# Altium schematic sheet Copy of ADN175_08_00_000_E4.SchDoc
size 604 x 426 mm; Organization: АДАНИ; Address1: -; Address4: Схема электрическая соединений; DocumentNumber: АДН175.08.00.000 Э4; Revision: АДН175.08.00.000; SheetNumber: 1; SheetTotal: 3; ApprovedBy: Фадеев; Author: Костин; DrawnBy: Лукашевич; Engineer: Монтволинская; Litera: 0; Формат: А1; DocumentName: КАБЕЛЬ
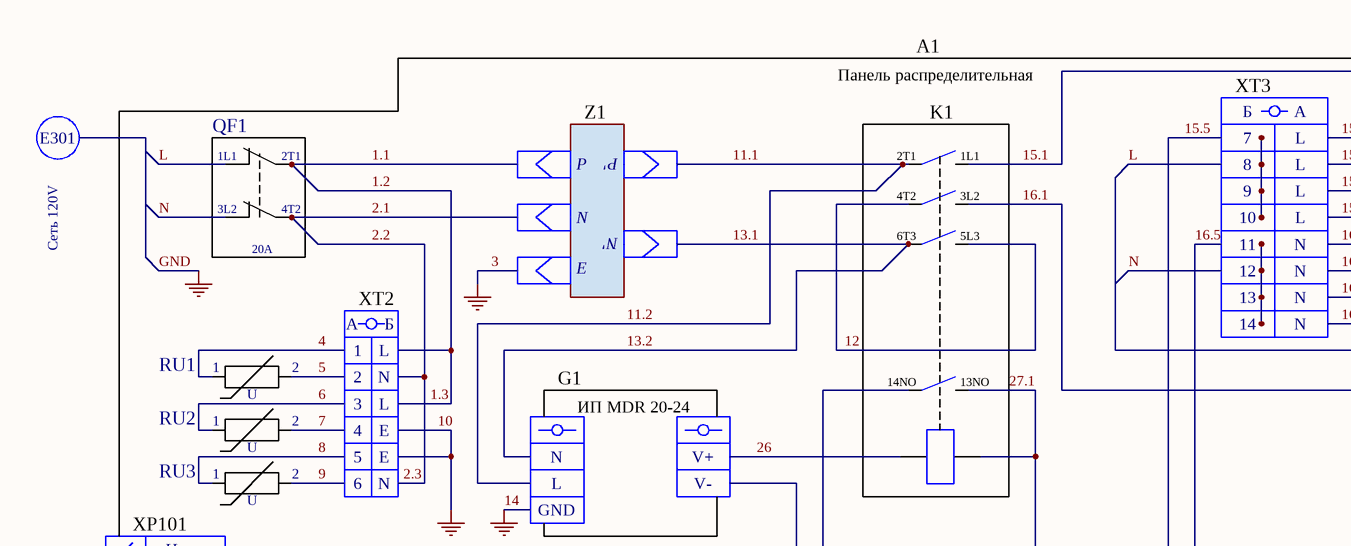
[diagram p0: Copy of ADN175_08_00_000_E4.SchDoc, top left]
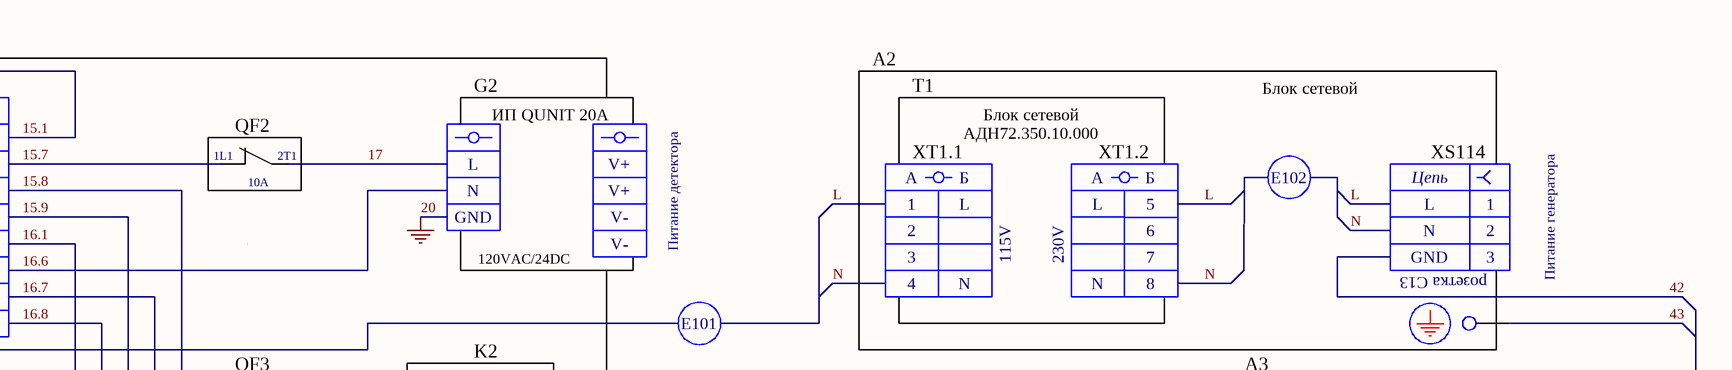
[diagram p1: Copy of ADN175_08_00_000_E4.SchDoc, top right]
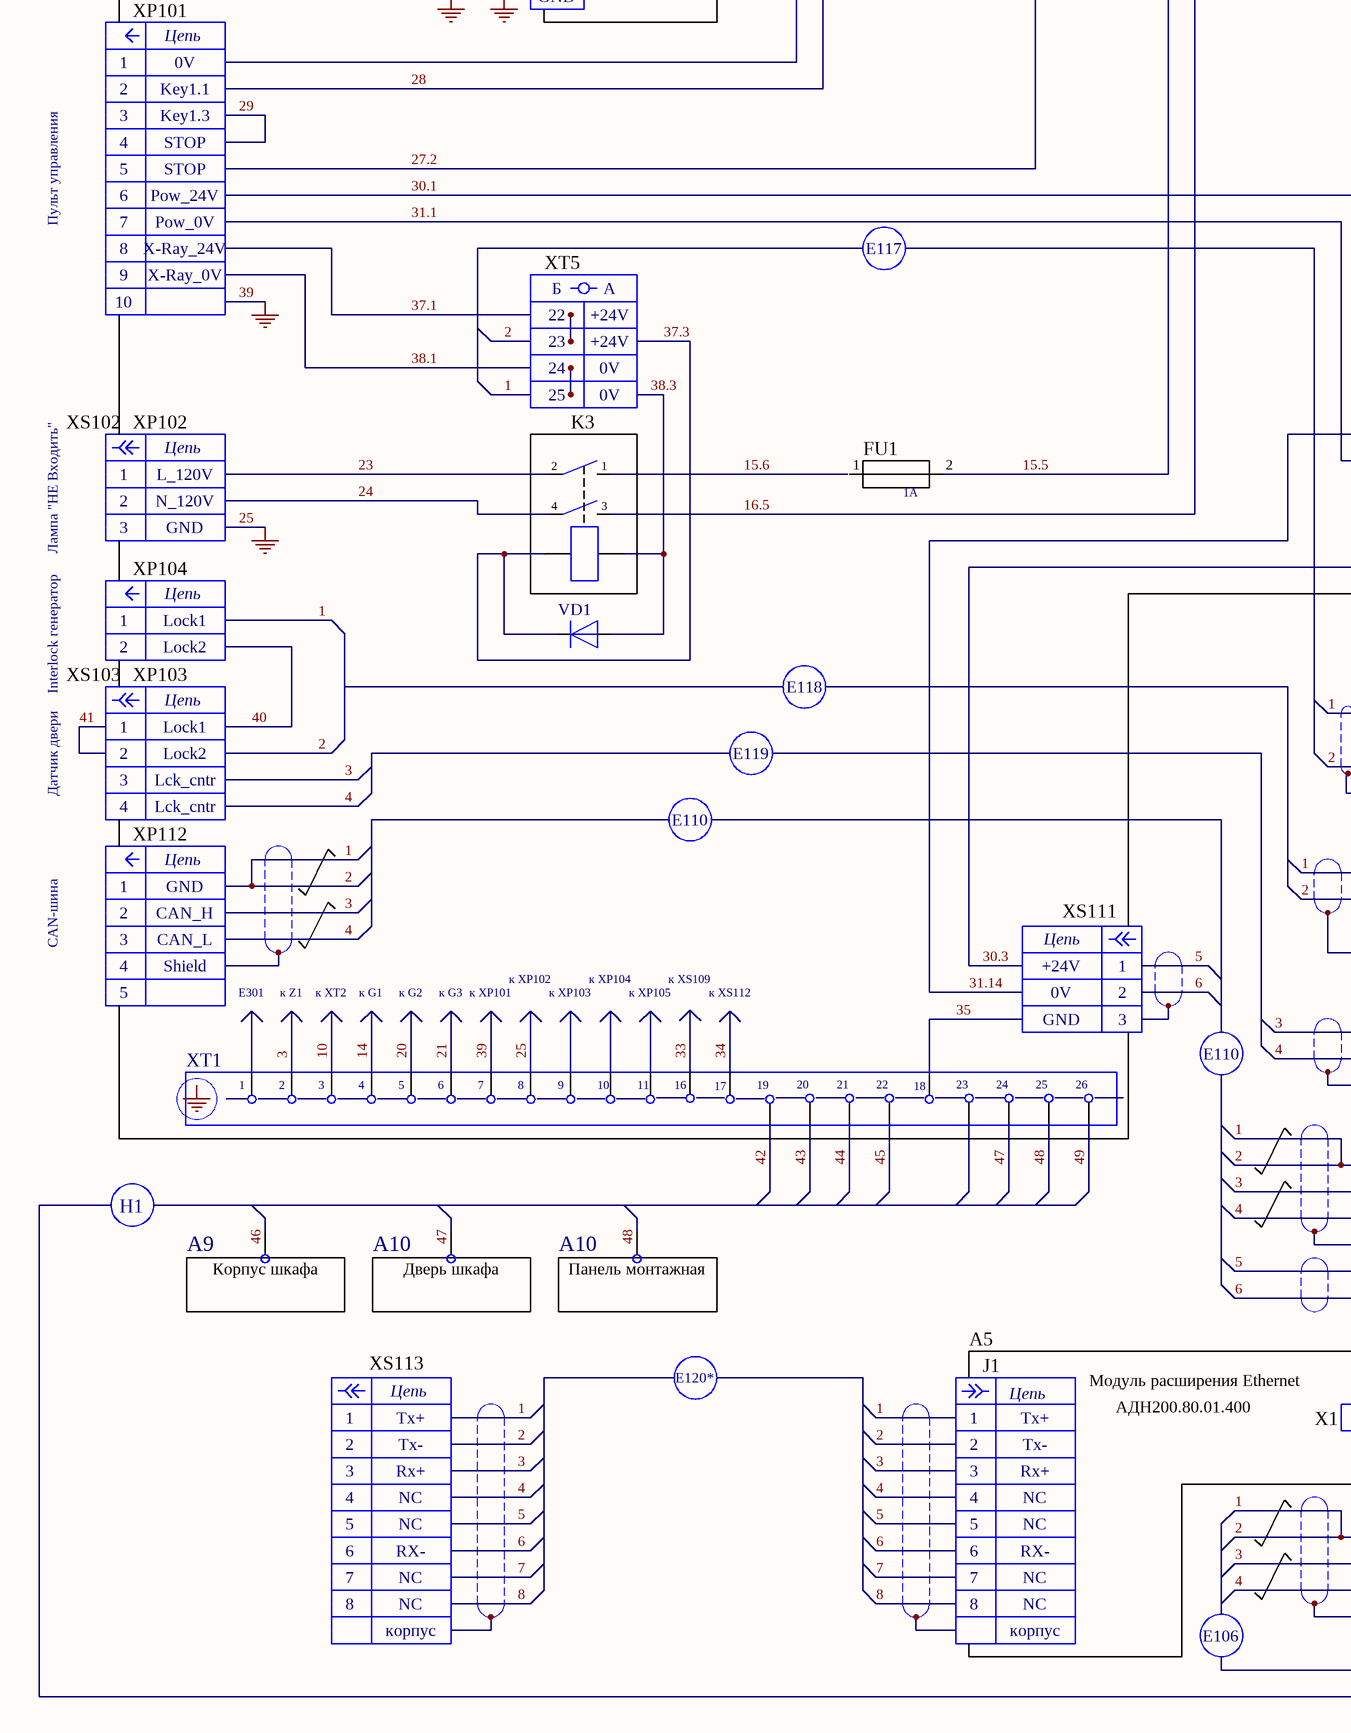
[diagram p2: Copy of ADN175_08_00_000_E4.SchDoc, bottom left]
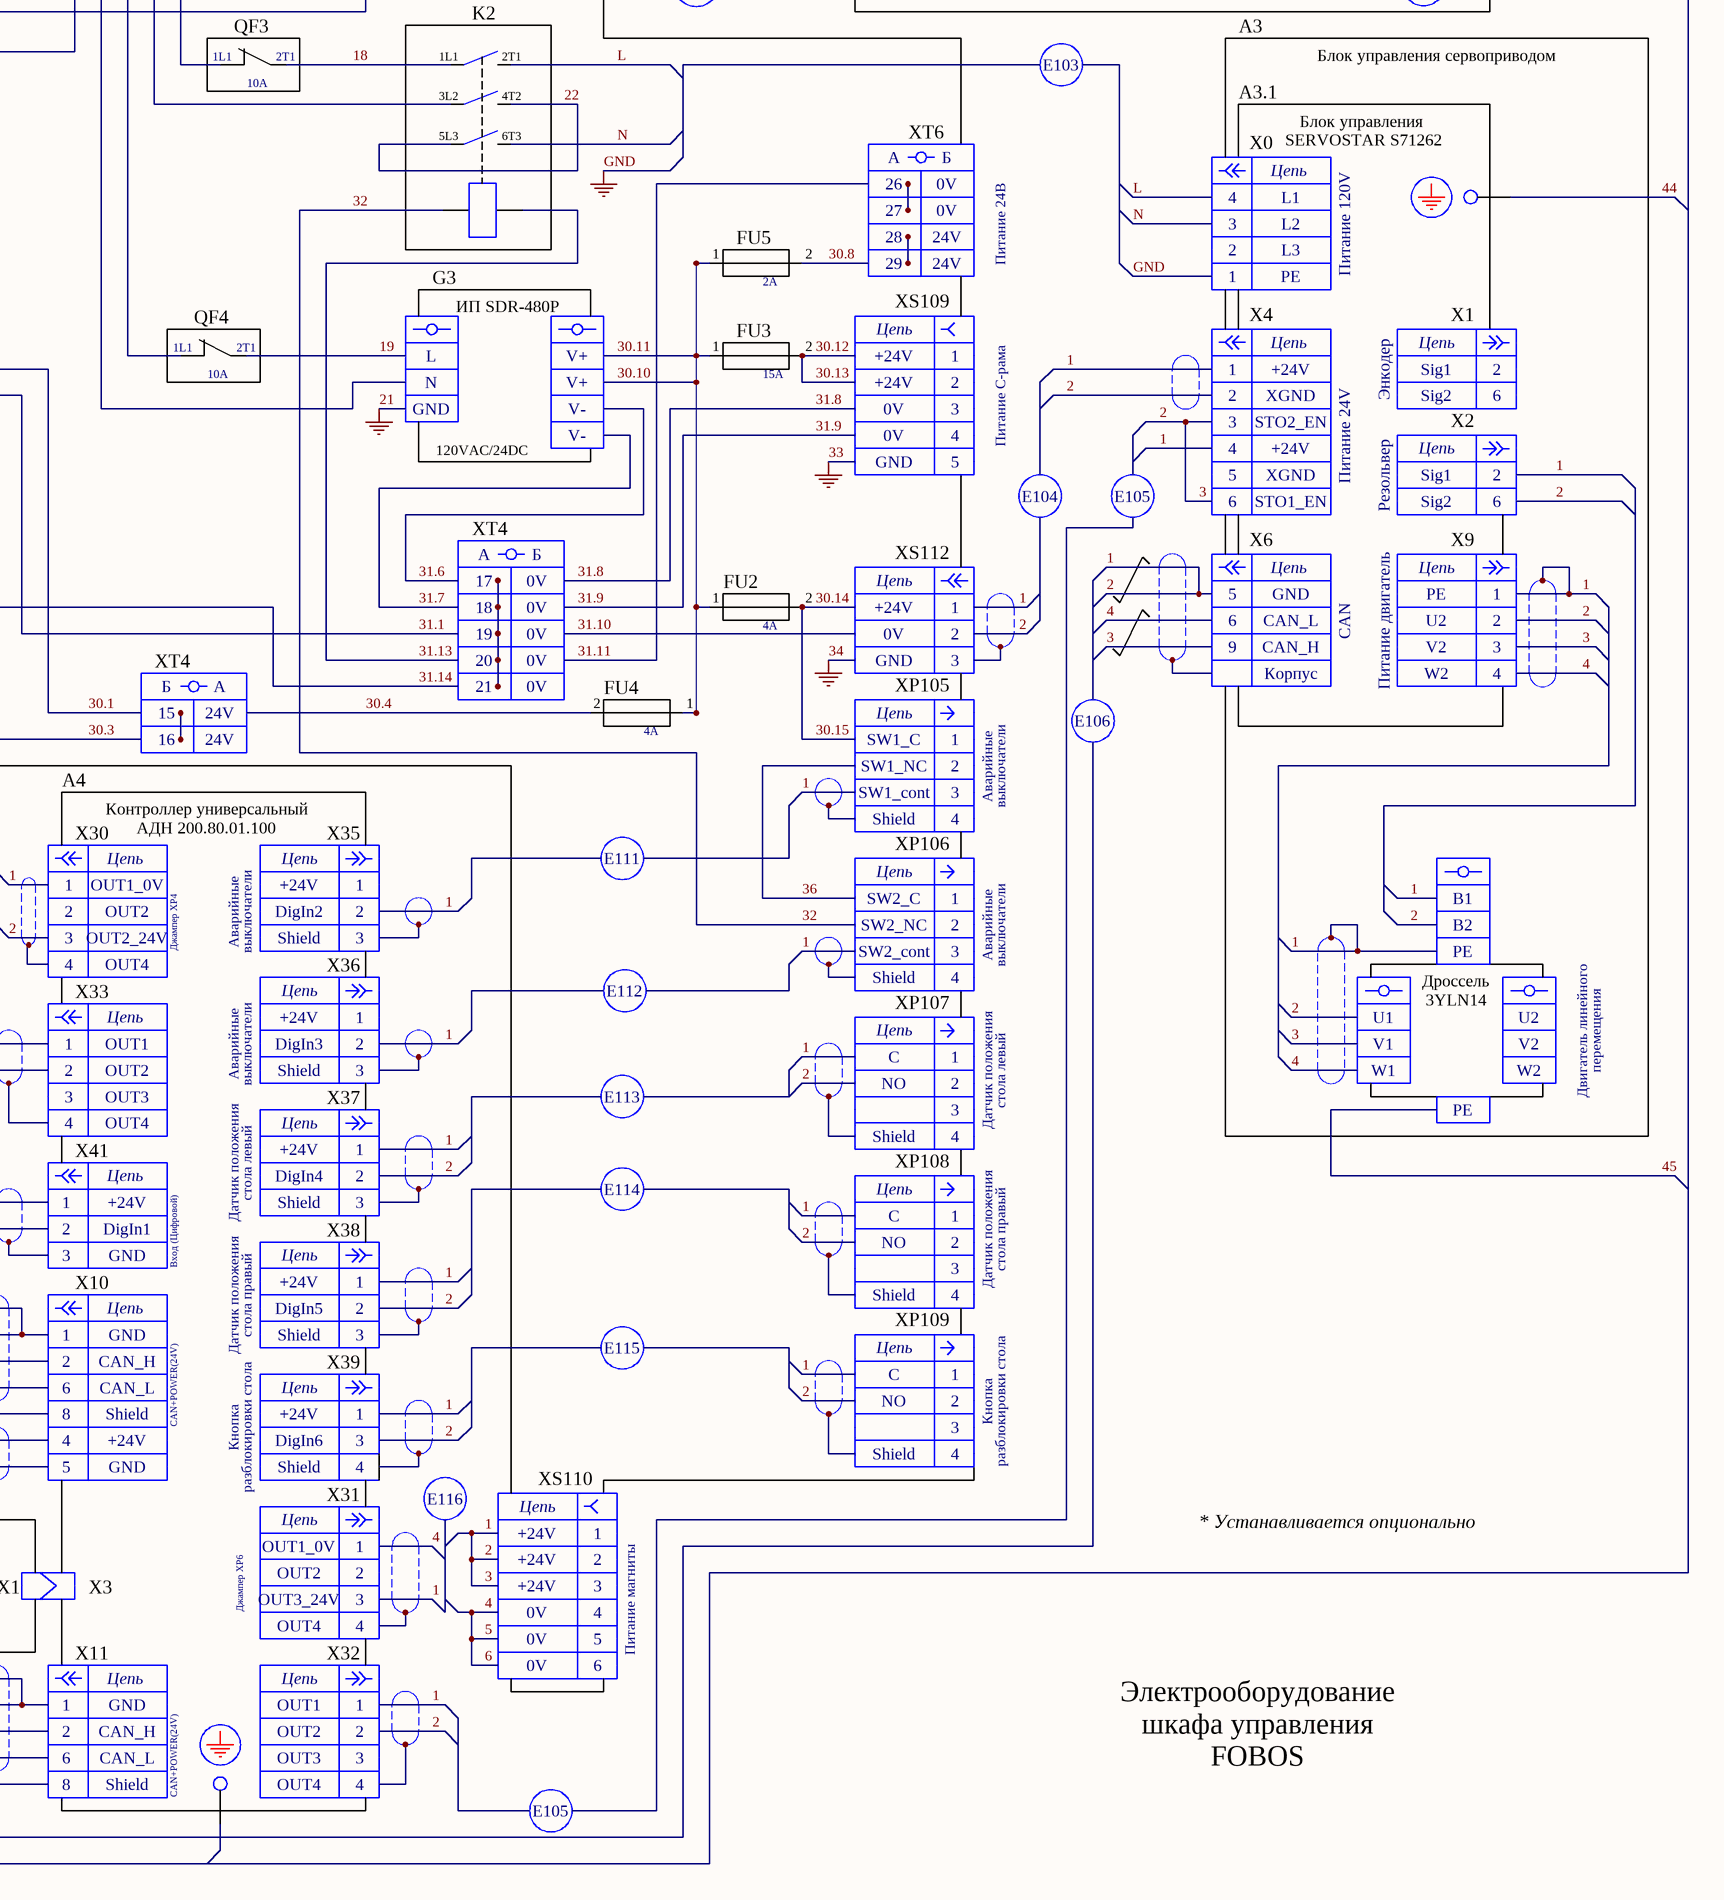
[diagram p3: Copy of ADN175_08_00_000_E4.SchDoc, bottom right]

## Parts
(Parts that share a designator on the sheet are numbered #1, #2 ... from top to bottom, then left to right.)
1  КОНТ_ПЛ_1  [PLS-1]  (value not drawn)
2  КОНТ_ПЛ_1  [PLS-1]  (value not drawn)
3  КОНТ_ПЛ_1  [PLS-1]  (value not drawn)
4  КОНТ_ПЛ_1  [PLS-1]  (value not drawn)
5  КОНТ_ПЛ_1  [PLS-1]  (value not drawn)
6  КОНТ_ПЛ_1  [PLS-1]  (value not drawn)
7  КОНТ_ПЛ_1  [PLS-1]  (value not drawn)
8  КОНТ_ПЛ_1  [PLS-1]  (value not drawn)
9  КОНТ_ПЛ_1  [PLS-1]  (value not drawn)
10  КОНТ_ПЛ_1  [PLS-1]  (value not drawn)
11  КОНТ_ПЛ_1  [PLS-1]  (value not drawn)
16  КОНТ_ПЛ_1  [PLS-1]  (value not drawn)
17  КОНТ_ПЛ_1  [PLS-1]  (value not drawn)
18  КОНТ_ПЛ_1  [PLS-1]  (value not drawn)
19  КОНТ_ПЛ_1  [PLS-1]  (value not drawn)
20  КОНТ_ПЛ_1  [PLS-1]  (value not drawn)
21  КОНТ_ПЛ_1  [PLS-1]  (value not drawn)
22  КОНТ_ПЛ_1  [PLS-1]  (value not drawn)
23  КОНТ_ПЛ_1  [PLS-1]  (value not drawn)
24  КОНТ_ПЛ_1  [PLS-1]  (value not drawn)
25  КОНТ_ПЛ_1  [PLS-1]  (value not drawn)
26  КОНТ_ПЛ_1  [PLS-1]  (value not drawn)
*#1  Component_1  (value not drawn)
*#2  Component_1  (value not drawn)
*#3  Component_1  (value not drawn)
*#4  Component_1  (value not drawn)
*#5  Component_1  (value not drawn)
*#6  Component_1  (value not drawn)
*#7  Component_1  (value not drawn)
*#8  Component_1  (value not drawn)
*#9  Component_1  (value not drawn)
*#10  Component_1  (value not drawn)
*#11  Component_1  (value not drawn)
*#12  Component_1  (value not drawn)
*#13  Component_1  (value not drawn)
*#14  in  (value not drawn)
*#15  in  (value not drawn)
*#16  in  (value not drawn)
*#17  in  (value not drawn)
*#18  in  (value not drawn)
*#19  in  (value not drawn)
*#20  in  (value not drawn)
*#21  in  (value not drawn)
*#22  in  (value not drawn)
*#23  in  (value not drawn)
*#24  in  (value not drawn)
*#25  in  (value not drawn)
*#26  in  (value not drawn)
*?#1  Component_1  (value not drawn)
*?#2  Component_1  (value not drawn)
*?#3  Component_1  (value not drawn)
*?#4  Component_1  (value not drawn)
*?#5  Component_1  (value not drawn)
*?#6  Component_1  (value not drawn)
*?#7  Component_1  (value not drawn)
*?#8  Component_1  (value not drawn)
*?#9  Component_1  (value not drawn)
*?#10  Component_1  (value not drawn)
*?#11  Component_1  (value not drawn)
*?#12  Component_1  (value not drawn)
*?#13  Component_1  (value not drawn)
*?#14  Component_1  (value not drawn)
*?#15  Component_1  (value not drawn)
*?#16  Component_1  (value not drawn)
*?#17  Component_1  (value not drawn)
*?#18  Component_1  (value not drawn)
*?#19  Component_1  (value not drawn)
*?#20  Component_1  (value not drawn)
*?#21  Component_1  (value not drawn)
*?#22  Component_1  (value not drawn)
*?#23  Component_1  (value not drawn)
*?#24  Component_1  (value not drawn)
*?#25  Component_1  (value not drawn)
*?#26  Component_1  (value not drawn)
*?#27  Component_1  (value not drawn)
*?#28  Component_1  (value not drawn)
*?#29  Component_1  (value not drawn)
*?#30  Component_1  (value not drawn)
*?#31  Component_1  (value not drawn)
*?#32  Component_1  (value not drawn)
*?#33  Component_1  (value not drawn)
*?#34  Component_1  (value not drawn)
*?#35  Component_1  (value not drawn)
*?#36  Component_1  (value not drawn)
*?#37  Component_1  (value not drawn)
*?#38  Component_1  (value not drawn)
*?#39  Component_1  (value not drawn)
*?#40  Component_1  (value not drawn)
*?#41  Component_1  (value not drawn)
*?#42  Component_1  (value not drawn)
*?#43  Component_1  (value not drawn)
*?#44  Component_1  (value not drawn)
*?#45  Component_1  (value not drawn)
*?#46  Component_1  (value not drawn)
*?#47  Component_1  (value not drawn)
*?#48  Component_1  (value not drawn)
*?#49  Component_1  (value not drawn)
*?#50  Component_1  (value not drawn)
*?#51  Component_1  (value not drawn)
*?#52  Component_1  (value not drawn)
*?#53  Component_1  (value not drawn)
*?#54  Component_1  (value not drawn)
*?#55  Component_1  (value not drawn)
*?#56  Component_1  (value not drawn)
*?#57  Component_1  (value not drawn)
*?#58  Component_1  (value not drawn)
*?#59  Component_1  (value not drawn)
*?#60  Component_1  (value not drawn)
*?#61  Component_1  (value not drawn)
*?#62  Component_1  (value not drawn)
*?#63  Component_1  (value not drawn)
*?#64  Component_1  (value not drawn)
*?#65  Component_1  (value not drawn)
*?#66  Component_1  (value not drawn)
*?#67  Component_1  (value not drawn)
*?#68  Component_1  (value not drawn)
*?#69  Component_1  (value not drawn)
*?#70  Component_1  (value not drawn)
*?#71  Component_1  (value not drawn)
*?#72  Component_1  (value not drawn)
*?#73  Component_1  (value not drawn)
*?#74  Component_1  (value not drawn)
*?#75  Component_1  (value not drawn)
*?#76  Component_1  (value not drawn)
*?#77  Component_1  (value not drawn)
*?#78  Component_1  (value not drawn)
?#1  Цепь  Обозначение?: XS114
?#2  Цепь  Обозначение?: X0
?#3  GND  (value not drawn)
?#4  Цепь  Обозначение?: XP101
?#5  GND  (value not drawn)
?#6  GND  (value not drawn)
?#7  GND  (value not drawn)
?#8  Цепь  Обозначение?: X4
?#9  Цепь  Обозначение?: XS109
?#10  GND  (value not drawn)
?#11  Цепь  Обозначение?: X1
?#12  GND  (value not drawn)
?#13  GND  (value not drawn)
?#14  GND  (value not drawn)
?#15  GND  (value not drawn)
?#16  Цепь  Обозначение?: X2
?#17  GND  (value not drawn)
?#18  Цепь  Обозначение?: X6
?#19  GND  (value not drawn)
?#20  Цепь  Обозначение?: X9
?#21  Цепь  Обозначение?: XS112
?#22  Цепь  Обозначение?: XP102
?#23  GND  (value not drawn)
?#24  GND  (value not drawn)
?#25  GND  (value not drawn)
?#26  Цепь  Обозначение?: XP105
?#27  Цепь  Обозначение?: XP104
?#28  Цепь  Обозначение?: X30
?#29  Цепь  Обозначение?: XP103
?#30  Цепь  Обозначение?: X35
?#31  Цепь  Обозначение?: XP106
?#32  Цепь  Обозначение?: X33
?#33  Цепь  Обозначение?: X36
?#34  Цепь  Обозначение?: XP112
?#35  Цепь  Обозначение?: XP107
?#36  Цепь  Обозначение?: XS111
?#37  Цепь  Обозначение?: X37
?#38  Цепь  Обозначение?: X41
?#39  Цепь  Обозначение?: XP108
?#40  Цепь  Обозначение?: X38
?#41  Цепь  Обозначение?: X10
?#42  Цепь  Обозначение?: XP109
?#43  Цепь  Обозначение?: X39
?#44  XT11  [PLS-1]  (value not drawn)
?#45  XT11  [PLS-1]  (value not drawn)
?#46  XT11  [PLS-1]  (value not drawn)
?#47  Цепь  Обозначение?: XS110
?#48  Цепь  Обозначение?: X31
?#49  Цепь  Обозначение?: XS113
?#50  Цепь  Обозначение?: J1
?#51  GND  (value not drawn)
?#52  GND  (value not drawn)
?#53  GND  (value not drawn)
?#54  GND  (value not drawn)
?#55  Цепь  Обозначение?: X11
?#56  GND  (value not drawn)
?#57  Цепь  Обозначение?: X32
?#58  GND  (value not drawn)
?#59  GND  (value not drawn)
?#60  GND  (value not drawn)
?#61  GND  (value not drawn)
E101  cable_number  (value not drawn)
E102  cable_number  (value not drawn)
E103  cable_number  (value not drawn)
E104  cable_number  (value not drawn)
E105#1  cable_number  (value not drawn)
E105#2  cable_number  (value not drawn)
E106#1  cable_number  (value not drawn)
E106#2  cable_number  (value not drawn)
E110#1  cable_number  (value not drawn)
E110#2  cable_number  (value not drawn)
E111  cable_number  (value not drawn)
E112  cable_number  (value not drawn)
E113  cable_number  (value not drawn)
E114  cable_number  (value not drawn)
E115  cable_number  (value not drawn)
E116  cable_number  (value not drawn)
E117  cable_number  (value not drawn)
E118  cable_number  (value not drawn)
E119  cable_number  (value not drawn)
E120*  cable_number  (value not drawn)
E301  cable_number  (value not drawn)
FU1  1A
FU2  4A
FU3  15A
FU4  4A
FU5  2A
H1  cable_number  (value not drawn)
K1.1#1  (no value)
K1.1#2  (no value)
K1.2#1  (no value)
K1.2#2  (no value)
K1.2#3  (no value)
K1.2#4  (no value)
K?#1  (no value)
K?#2  (no value)
K?#3  (no value)
KA?#1  RELAY  (value not drawn)
KA?#2  RELAY  (value not drawn)
KA?#3  RELAY  (value not drawn)
QF1  20A
QF2  10A
QF3  10A
QF4  10A
RU1  varistor  (value not drawn)
RU2  varistor  (value not drawn)
RU3  varistor  (value not drawn)
VD1  DIODE1  [0805]  (value not drawn)
X1  male  (value not drawn)
X3  female  (value not drawn)
XK?#1  КОНТАКТ_ПЛ  [PLS-1]  (value not drawn)
XK?#2  КОНТАКТ_ПЛ  [PLS-1]  (value not drawn)
XK?#3  КОНТАКТ_ПЛ  [PLS-1]  (value not drawn)
XP?#1  male  (value not drawn)
XP?#2  male  (value not drawn)
XP?#3  male  (value not drawn)
XP?#4  male  (value not drawn)
XP?#5  male  (value not drawn)
XS?#1  female  (value not drawn)
XS?#2  female  (value not drawn)
XS?#3  female  (value not drawn)
XS?#4  female  (value not drawn)
XS?#5  female  (value not drawn)
№?#1  Цепь?  (value not drawn)
№?#2  Цепь?  (value not drawn)
№?#3  Цепь?  (value not drawn)
№?#4  Цепь?  (value not drawn)
№?#5  Цепь?  (value not drawn)
№?#6  Цепь?  (value not drawn)
№?#7  Цепь?  (value not drawn)
№?#8  Цепь?  (value not drawn)
№?#9  Цепь?  (value not drawn)
№?#10  Цепь?  (value not drawn)
№?#11  Цепь?  (value not drawn)
№?#12  Цепь?  (value not drawn)
№?#13  Цепь?  (value not drawn)
№?#14  Цепь?  (value not drawn)
№?#15  Цепь?  (value not drawn)
№?#16  Цепь?  (value not drawn)
№?#17  Цепь?  (value not drawn)
№?#18  Цепь?  (value not drawn)
№?#19  Цепь?  (value not drawn)
№?#20  Цепь?  (value not drawn)
№?#21  Цепь?  (value not drawn)
№?#22  Цепь?  (value not drawn)
№?#23  Цепь?  (value not drawn)
№?#24  Цепь?  (value not drawn)
№?#25  Цепь?  (value not drawn)
№?#26  Цепь?  (value not drawn)
№?#27  Цепь?  (value not drawn)
№?#28  Цепь?  (value not drawn)
№?#29  Цепь?  (value not drawn)
№?#30  Цепь?  (value not drawn)
№?#31  Цепь?  (value not drawn)
№?#32  Цепь?  (value not drawn)
№?#33  Цепь?  (value not drawn)
№?#34  Цепь?  (value not drawn)
№?#35  Цепь?  (value not drawn)
№?#36  Цепь?  (value not drawn)
№?#37  Цепь?  (value not drawn)
№?#38  Цепь?  (value not drawn)
№?#39  Цепь?  (value not drawn)
№?#40  Цепь?  (value not drawn)
№?#41  Цепь?  (value not drawn)
№?#42  Цепь?  (value not drawn)
№?#43  Цепь?  (value not drawn)
№?#44  Цепь?  (value not drawn)
№?#45  Цепь?  (value not drawn)
№?#46  Цепь?  (value not drawn)
№?#47  Цепь?  (value not drawn)
№?#48  Цепь?  (value not drawn)
№?#49  Цепь?  (value not drawn)
№?#50  Цепь?  (value not drawn)
№?#51  Цепь?  (value not drawn)
№?#52  Цепь?  (value not drawn)
№?#53  Цепь?  (value not drawn)
№?#54  Цепь?  (value not drawn)
№?#55  Цепь?  (value not drawn)
№?#56  Цепь?  (value not drawn)
№?#57  Цепь?  (value not drawn)
№?#58  Цепь?  (value not drawn)
№?#59  Цепь?  (value not drawn)
№?#60  Цепь?  (value not drawn)
№?#61  Цепь?  (value not drawn)
№?#62  Цепь?  (value not drawn)
№?#63  Цепь?  (value not drawn)
№?#64  Цепь?  (value not drawn)
№?#65  Цепь?  (value not drawn)
№?#66  Цепь?  (value not drawn)
№?#67  Цепь?  (value not drawn)
№?#68  Цепь?  (value not drawn)
№?#69  Цепь?  (value not drawn)
№?#70  Цепь?  (value not drawn)
№?#71  Цепь?  (value not drawn)
№?#72  Цепь?  (value not drawn)
№?#73  Цепь?  (value not drawn)
№?#74  Цепь?  (value not drawn)
№?#75  Цепь?  (value not drawn)
№?#76  Цепь?  (value not drawn)
№?#77  Цепь?  (value not drawn)
№?#78  Цепь?  (value not drawn)
№?#79  Цепь?  (value not drawn)
№?#80  Цепь?  (value not drawn)
№?#81  Цепь?  (value not drawn)
№?#82  Цепь?  (value not drawn)
№?#83  Цепь?  (value not drawn)
№?#84  Цепь?  (value not drawn)
№?#85  Цепь?  (value not drawn)
№?#86  Цепь?  (value not drawn)
№?#87  Цепь?  (value not drawn)
№?#88  Цепь?  (value not drawn)
№?#89  Цепь?  (value not drawn)
№?#90  Цепь?  (value not drawn)
№?#91  Цепь?  (value not drawn)
№?#92  Цепь?  (value not drawn)
№?#93  Цепь?  (value not drawn)
№?#94  Цепь?  (value not drawn)
№?#95  Цепь?  (value not drawn)
№?#96  Цепь?  (value not drawn)
№?#97  Цепь?  (value not drawn)
№?#98  Цепь?  (value not drawn)
№?#99  Цепь?  (value not drawn)
№?#100  Цепь?  (value not drawn)
№?#101  Цепь?  (value not drawn)
№?#102  Цепь?  (value not drawn)
№?#103  Цепь?  (value not drawn)
№?#104  Цепь?  (value not drawn)
№?#105  Цепь?  (value not drawn)
№?#106  Цепь?  (value not drawn)
№?#107  Цепь?  (value not drawn)
№?#108  Цепь?  (value not drawn)
№?#109  Цепь?  (value not drawn)
№?#110  Цепь?  (value not drawn)
№?#111  Цепь?  (value not drawn)
№?#112  Цепь?  (value not drawn)
№?#113  Цепь?  (value not drawn)
№?#114  Цепь?  (value not drawn)
№?#115  Цепь?  (value not drawn)
№?#116  Цепь?  (value not drawn)
№?#117  Цепь?  (value not drawn)
№?#118  Цепь?  (value not drawn)
№?#119  Цепь?  (value not drawn)
№?#120  Цепь?  (value not drawn)
№?#121  Цепь?  (value not drawn)
№?#122  Цепь?  (value not drawn)
№?#123  Цепь?  (value not drawn)
№?#124  Цепь?  (value not drawn)
№?#125  Цепь?  (value not drawn)
№?#126  Цепь?  (value not drawn)
№?#127  Цепь?  (value not drawn)
№?#128  Цепь?  (value not drawn)
№?#129  Цепь?  (value not drawn)
№?#130  Цепь?  (value not drawn)
№?#131  Цепь?  (value not drawn)

## Blocks framed on the sheet
Z1: XP?#2 XP?#5
K1: K1.1#1 K1.1#2 K?#1 K?#2 KA?#1
K2: K1.2#1 K1.2#2 K?#3 KA?#2
K3: K1.2#3 K1.2#4 KA?#3
XT1: 1-11 16-26

## Nets
1: 2.1 3.1 4.1 5.1 6.1 7.1 8.1 16.1 17.1 *#5.0 *#8.0 *#12.0 *#14.4 *#16.4 *#17.4 *#18.4 *#19.4 *#20.4 *#21.4 *#22.4 *#26.4 *?#17.0 *?#52.0 *?#69.0 *?#70.0 *?#71.0 *?#72.0 *?#74.0 ?#7.5 ?#10.5 ?#12.5 ?#13.5 ?#14.5 ?#17.5 ?#19.5 ?#24.5 ?#51.5 ?#52.5 ?#53.5 XS?#5.10 №?#7.8 №?#8.8 №?#25.6 №?#26.6 №?#27.5 №?#28.5 №?#29.5 №?#30.5 №?#32.5 №?#33.5 №?#35.5 №?#36.6 №?#37.6 №?#40.6 №?#43.6 №?#45.5 №?#49.6 №?#51.5 №?#52.5 №?#53.6 №?#58.6 №?#60.5 №?#62.6 №?#63.5 №?#64.5 №?#65.6 №?#66.6 №?#70.6 №?#77.5 №?#79.5 №?#80.5 №?#84.6 №?#86.6 №?#88.5 №?#91.5 №?#95.6 №?#97.6 №?#99.5 №?#102.5 №?#105.6 №?#107.6 №?#108.6 №?#110.6 №?#111.6 №?#112.5 №?#113.6 №?#123.5 №?#126.5  [also labelled 10, 14, 2, 20, 21, 25, 3, 33, 34, 39, GND]
1.1: QF1.2T1 XS?#2.10 №?#4.8 №?#6.8  [also labelled 1.2, 1.3]
2.1: QF1.2T2 XS?#3.10 №?#5.8 №?#9.8  [also labelled 2.2, 2.3]
4: *?#76.0 ?#23.5 ?#54.5 ?#56.5 ?#58.5 RU1.2 RU1.3 RU2.2 №?#4.7 №?#5.7 №?#6.7 №?#38.5 №?#57.6 №?#69.6 №?#75.5 №?#78.5 №?#82.5 №?#106.5 №?#114.6 №?#116.6 №?#118.6 №?#121.6  [also labelled 5, 6]
7: ?#59.5 RU2.3 №?#7.7 №?#124.6
8: ?#60.5 RU3.2 №?#8.7 №?#127.6
9: RU3.3 №?#9.7
11.1: *#3.0 K1.1#1.2T1 XS?#1.10  [also labelled 11.2]
12: K1.1#2.4T2 K?#1.5L3
13.1: *#1.0 K?#1.6T3 XS?#4.10  [also labelled 13.2]
15.1: *?#2.1 K1.1#1.1L1
15.5: *?#1.0 FU1.2
15.6: K1.2#3.1
15.7: *?#4.1 QF2.2T2
15.8: *?#8.1 QF3.2T2
15.9: *?#16.1 QF4.2T2
16.1: *?#24.1 K1.1#2.3L2
16.5: *?#23.0 K1.2#4.3
16.6: *?#9.0 *?#31.1
16.7: *?#37.1 K1.2#2.3L2
16.8: *?#39.1 *?#50.0
17: *?#5.0 QF2.2T1
18: K1.2#1.1L1 QF3.2T1
19: *?#48.0 QF4.2T1
22: K1.2#2.4T2 K?#3.5L3
23: K1.2#3.2 №?#31.6
24: K1.2#4.4 №?#34.6
26: *#2.1 KA?#1.A1
27.1: K?#2.13NO KA?#1.A2 №?#14.6  [also labelled 27.2]
28: K?#2.14NO №?#11.6
29: №?#12.6 №?#13.6
30.1: *?#65.0 №?#15.6
30.3: *?#67.0 №?#75.6
30.4: *?#66.1 FU4.2
30.8: *?#46.0 FU5.2
30.10: *?#51.1
30.11: *?#49.1 FU3.1
30.12: FU3.2 №?#16.6 №?#19.6  [also labelled 30.13]
30.14: FU2.2 №?#30.6 №?#39.6  [also labelled 30.15]
31.1: *?#59.0 №?#17.6
31.6: *?#53.1 *?#55.0
31.7: *?#54.1 *?#57.0
31.8: *?#56.1 №?#22.6
31.9: *?#58.1 №?#24.6
31.10: *?#60.1 №?#33.6
31.11: *?#40.0 *?#62.1
31.13: *?#61.0 KA?#2.A2
31.14: *?#63.0 №?#78.6
32: KA?#2.A1 №?#54.6
35: 18.1 №?#81.6
36: №?#41.6 №?#50.6
37.1: *#6.0 №?#20.6
37.3: *#9.1 KA?#3.A1 VD1.2(K)
38.1: *#10.0 №?#23.6
38.3: *#13.1 KA?#3.A2 VD1.1(A)
40: №?#42.6 №?#46.6
41: №?#46.5 №?#49.5
42: 19.1 №?#3.6
43: 20.1 XK?#1.1
44: 21.1 XK?#2.1
45: 22.1 *?#78.0
47: 24.1
48: 25.1
49: 26.1
L: *?#3.0 *?#11.0 *?#14.1 ?#3.5 K1.2#1.2T1 QF1.2T2 №?#1.6
N: *?#30.0 *?#32.0 *?#35.1 ?#5.5 K?#3.6T3 QF1.2T3 №?#2.6
Net1_1: 1.1 *#15.4
Net9_1: 9.1 *#23.4
Net10_1: 10.1 *#24.4
Net11_1: 11.1 *#25.4
Net*#4_1: *#4.1 №?#10.6
Net*#6_1: *#6.1 *#7.0
Net*#8_1: *#8.1 *#9.0
Net*#10_1: *#10.1 *#11.0
Net*#12_1: *#12.1 *#13.0
Net*?#1_1: *?#1.1 *?#2.0
Net*?#3_1: *?#3.1 *?#4.0
Net*?#7_1: *?#7.1 *?#8.0
Net*?#11_1: *?#11.1 *?#12.0
Net*?#13_1: *?#13.1 *?#14.0
Net*?#15_1: *?#15.1 *?#16.0
Net*?#19_1: *?#19.1 *?#20.0
Net*?#21_1: *?#21.1 *?#22.0
Net*?#23_1: *?#23.1 *?#24.0
Net*?#26_1: *?#26.1 *?#27.0
Net*?#28_1: *?#28.1 *?#29.0
Net*?#30_1: *?#30.1 *?#31.0
Net*?#32_1: *?#32.1 *?#33.0
Net*?#34_1: *?#34.1 *?#35.0
Net*?#36_1: *?#36.1 *?#37.0
Net*?#38_1: *?#38.1 *?#39.0
Net*?#40_1: *?#40.1 *?#41.0
Net*?#42_1: *?#42.1 *?#43.0
Net*?#44_1: *?#44.1 *?#45.0
Net*?#46_1: *?#46.1 *?#47.0
Net*?#55_1: *?#55.1 *?#56.0
Net*?#57_1: *?#57.1 *?#58.0
Net*?#59_1: *?#59.1 *?#60.0
Net*?#61_1: *?#61.1 *?#62.0
Net*?#63_1: *?#63.1 *?#64.0
Net*?#65_1: *?#65.1 *?#66.0
Net*?#67_1: *?#67.1 *?#68.0

Not connected (* = marked no-connect by the designer): 23 1; *#1 1; *#2 0; *#3 1; *#4 0; *#5 1; *#7 1; *#11 1; *?#5 1; *?#6 0 1; *?#7 0; *?#9 1; *?#10 0 1; *?#12 1; *?#13 0; *?#15 0; *?#17 1; *?#18 0 1; *?#19 0; *?#20 1; *?#21 0; *?#22 1; *?#25 0 1; *?#26 0; *?#27 1; *?#28 0; *?#29 1; *?#33 1; *?#34 0; *?#36 0; *?#38 0; *?#41 1; *?#42 0; *?#43 1; *?#44 0; *?#45 1; *?#47 1; *?#48 1; *?#49 0; *?#50 1; *?#51 0; *?#52 1; *?#53 0; *?#54 0; *?#64 1; *?#68 1; *?#69 1; *?#70 1; *?#71 1; *?#72 1; *?#73 0 1; *?#74 1; *?#75 0 1; *?#76 1; *?#77 0 1; *?#78 1; ?#1 5; ?#4 5; ?#6 5; ?#9 5; ?#11 5; ?#15 5; ?#16 5; ?#20 5; ?#21 5; ?#22 5; ?#25 5; ?#26 5; ?#27 5; ?#29 5; ?#30 5; ?#31 5; ?#33 5; ?#34 5; ?#35 5; ?#36 5; ?#37 5; ?#38 5; ?#39 5; ?#40 5; ?#41 5; ?#42 5; ?#43 5; ?#44 1; ?#45 1; ?#46 1; ?#47 5; ?#48 5; ?#49 5; ?#55 5; ?#57 5; ?#61 5; E101 9 10 11; E102 9 10 11; E103 9 10 11; E104 9 10 11; E105#1 9 10 11; E105#2 9 10 11; E106#1 9 10 11; E106#2 9 10 11; E110#1 9 10 11; E110#2 9 10 11; E111 9 10 11; E112 9 10 11; E113 9 10 11; E114 9 10 11; E115 9 10 11; E116 9 10 11; E117 9 10 11; E118 9 10 11; E119 9 10 11; E120* 9 10 11; E301 9 10 11; FU1 1; FU2 1; FU4 1(2); FU5 1; H1 9 10 11; X1 9; X3 10; XK?#3 1; XP?#1 9; XP?#2 9; XP?#3 9; XP?#4 9; XP?#5 9; №?#1 5; №?#2 5; №?#3 5; №?#10 5; №?#11 5; №?#12 5; №?#13 5; №?#14 5; №?#15 5; №?#16 5; №?#17 5; №?#18 5 6; №?#19 5; №?#20 5; №?#21 5 6; №?#22 5; №?#23 5; №?#24 5; №?#25 5; №?#26 5; №?#27 6; №?#28 6; №?#29 6; №?#31 5; №?#32 6; №?#34 5; №?#35 6; №?#36 5; №?#37 5; №?#38 6; №?#39 5; №?#40 5; №?#41 5; №?#42 5; №?#43 5; №?#44 5 6; №?#47 5; №?#48 5 6; №?#50 5; №?#52 6; №?#53 5; №?#54 5; №?#55 5; №?#56 5 6; №?#57 5; №?#58 5; №?#59 5 6; №?#61 5 6; №?#62 5; №?#64 6; №?#65 5; №?#66 5; №?#67 5; №?#68 5 6; №?#69 5; №?#70 5; №?#71 5; №?#72 5 6; №?#73 5 6; №?#74 5 6; №?#76 5 6; №?#77 6; №?#79 6; №?#80 6; №?#81 5; №?#82 6; №?#83 5 6; №?#84 5; №?#85 5 6; №?#86 5; №?#87 5 6; №?#88 6; №?#89 5 6; №?#90 6; №?#91 6; №?#92 6; №?#93 5 6; №?#94 6; №?#95 5; №?#96 6; №?#97 5; №?#98 6; №?#99 6; №?#100 5 6; №?#101 6; №?#102 6; №?#103 5 6; №?#104 5 6; №?#105 5; №?#108 5; №?#109 5; №?#111 5; №?#114 5; №?#115 5; №?#117 5; №?#119 5; №?#120 6; №?#122 6; №?#124 5; №?#125 6; №?#127 5; №?#128 6; №?#129 5; №?#130 5 6; №?#131 5

## Notes on the sheet
- A1
- Панель распределительная
- (near *?#1) XT3
- (near *?#1) Б
- (near *?#2) А
- G2
- A2
- Т1
- (near XP?#2) P
- (near XP?#1) P'
- (near *?#1) 7
- (near *?#3) 8
- (near *?#7) 9
- (near *?#2) L
- (near *?#4) L
- (near *?#8) L
- (near *?#9) N
- (near *?#5) L
- (near *?#6) ИП QUNIT 20A
- (near *?#6) V+
- (near *?#10) V+
- (near *?#6) Питание детектора
- (near *?#11) 1
- (near *?#11) XT1.1
- (near *?#11) А
- (near *?#13) Блок сетевой
  АДН72.350.10.000
- (near *?#12) L
- (near *?#12) Б
- (near *?#13) L
- (near *?#13) XT1.2
- (near *?#13) А
- (near *?#14) 5
- (near *?#14) Б
- (near E102) Блок сетевой
- (near №?#1) L
- (near №?#1) 1
- (near E301) Сеть 120V
- (near XP?#3) N
- (near XP?#4) N'
- (near *?#15) 10
- (near *?#23) 11
- (near *?#30) 12
- (near *?#24) N
- (near *?#31) N
- (near *?#16) L
- (near *?#25) 120VAC/24DC
- (near *?#17) GND
- (near *?#18) V-
- (near *?#25) V-
- (near *?#26) 3
- (near *?#19) 2
- (near *?#27) 115V
- (near *?#21) 230V
- (near *?#22) 6
- (near *?#29) 7
- (near №?#3) GND
- (near №?#2) N
- (near №?#2) 2
- (near №?#3) 3
- (near №?#2) Питание генератора
- (near №?#4) А
- (near №?#4) XT2
- (near №?#4) Б
- (near XP?#5) E
- (near *?#36) 13
- (near *?#38) 14
- (near *?#37) N
- (near *?#39) N
- (near *?#32) 4
- (near *?#33) N
- (near *?#34) N
- (near *?#35) 8
- (near №?#3) розетка С13
- (near №?#4) 1
- (near №?#5) 2
- (near №?#6) 3
- (near №?#4) L
- (near №?#5) N
- (near №?#6) L
- G1
- A3
- (near №?#7) 4
- (near №?#8) 5
- (near №?#7) E
- (near №?#8) E
- (near *#1) N
- (near *#2) ИП MDR 20-24
- (near *#2) V+
- A3.1
- Блок управления сервоприводом
- (near №?#9) 6
- (near №?#9) N
- (near *#3) L
- (near *#5) GND
- (near *#4) V-
- (near *?#40) 26
- (near *?#40) А
- (near *?#40) XT6
- (near *?#41) 0V
- (near *?#41) Б
- (near ?#3) 4
- (near ?#2) Блок управления
  SERVOSTAR S71262
- (near ?#2) L1
- (near №?#10) 1
- (near №?#11) 2
- (near №?#10) 0V
- (near №?#11) Key1.1
- (near *?#42) 27
- (near *?#44) 28
- (near *?#46) 29
- (near *?#43) 0V
- (near *?#45) 24V
- (near *?#47) 24V
- (near *?#41) Питание 24В
- (near ?#5) 3
- (near ?#6) 2
- L2
- L3
- (near ?#2) Питание 120V
- (near №?#12) 3
- (near №?#13) 4
- (near №?#13) STOP
- (near №?#12) Key1.3
- G3
- (near ?#7) 1
- (near ?#8) PE
- (near №?#12) Пульт управления
- (near №?#14) 5
- (near №?#15) 6
- (near №?#17) 7
- (near №?#14) STOP
- (near №?#15) Pow_24V
- (near №?#17) Pow_0V
- (near *?#50) N
- (near *?#48) L
- (near *?#49) ИП SDR-480P
- (near *?#49) V+
- (near *?#51) V+
- (near №?#16) +24V
- (near №?#19) +24V
- (near №?#16) 1
- (near №?#19) 2
- (near №?#19) Питание С-рама
- (near ?#10) 1
- (near ?#12) 2
- (near ?#8) +24V
- XGND
- (near №?#18) Энкодер
- (near №?#18) Sig1
- (near №?#21) Sig2
- (near №?#21) 6
- (near №?#18) 2
- (near №?#20) 8
- (near №?#23) 9
- (near №?#20) X-Ray_24V
- (near №?#23) X-Ray_0V
- (near *#6) XT5
- (near *#6) Б
- (near *#7) А
- (near *?#54) 120VAC/24DC
- (near *?#52) GND
- (near *?#53) V-
- (near *?#54) V-
- (near №?#26) GND
- (near №?#22) 0V
- (near №?#24) 0V
- (near №?#26) 5
- (near №?#22) 3
- (near №?#24) 4
- (near ?#13) 3
- (near ?#14) 4
- (near ?#13) STO2_EN
- +24V
- (near №?#27) Питание 24V
- (near №?#25) 10
- (near *#6) 22
- (near *#8) 23
- (near *#7) +24V
- (near *#9) +24V
- (near ?#15) 5
- (near ?#17) 6
- (near ?#18) STO1_EN
- (near №?#27) Резольвер
- (near №?#27) Sig1
- (near №?#28) Sig2
- (near №?#28) 6
- (near №?#27) 2
- (near *#10) 24
- (near *#12) 25
- (near *#11) 0V
- (near *#13) 0V
- (near *?#55) XT4
- (near *?#55) 17
- (near *?#55) А
- (near *?#56) 0V
- (near *?#56) Б
- (near ?#19) 5
- (near ?#18) GND
- (near №?#29) PE
- (near №?#29) 1
- Лампа "НЕ Входить"
- (near ?#22) XS102
- (near №?#31) 1
- (near №?#34) 2
- (near №?#31) L_120V
- (near №?#34) N_120V
- (near *?#65) XT4
- (near *?#57) 18
- (near *?#59) 19
- (near *?#61) 20
- (near *?#58) 0V
- (near *?#60) 0V
- (near *?#62) 0V
- (near №?#30) +24V
- (near №?#33) 0V
- (near №?#36) GND
- (near №?#30) 1
- (near №?#33) 2
- (near №?#36) 3
- (near ?#23) 6
- (near ?#24) 9
- CAN_L
- Корпус
- CAN_H
- (near №?#32) CAN
- (near №?#29) Питание двигатель
- (near №?#32) U2
- (near №?#35) V2
- (near №?#38) W2
- (near №?#32) 2
- (near №?#35) 3
- (near №?#38) 4
- (near №?#37) 3
- (near №?#37) GND
- (near *?#65) 15
- (near *?#67) 16
- (near *?#65) Б
- (near *?#66) 24V
- (near *?#66) А
- (near *?#68) 24V
- (near *?#63) 21
- (near *?#64) 0V
- (near №?#39) SW1_C
- (near №?#39) 1
- (near ?#29) Interlock генератор
- (near №?#40) 1
- (near №?#40) Lock1
- A4
- (near №?#41) SW1_NC
- (near №?#43) SW1_cont
- (near №?#41) 2
- (near №?#43) 3
- (near №?#41) Аварийные
- (near №?#41) выключатели
- XS103
- (near №?#42) 2
- (near №?#42) Lock2
- (near ?#28) Контроллер универсальный
  АДН 200.80.01.100
- (near №?#44) Shield
- (near №?#44) 4
- (near №?#46) Датчик двери
- (near №?#46) 1
- (near №?#49) 2
- (near №?#46) Lock1
- (near №?#49) Lock2
- (near №?#45) 1
- (near №?#47) 2
- (near №?#51) 3
- (near №?#51) OUT2_24V
- OUT1_0V
- OUT2
- (near №?#48) Аварийные
- (near №?#48) выключатели
- (near №?#56) Shield
- (near №?#52) DigIn2
- (near №?#48) +24V
- (near №?#52) 2
- (near №?#56) 3
- (near №?#48) 1
- (near №?#50) SW2_C
- (near №?#54) SW2_NC
- (near №?#50) 1
- (near №?#54) 2
- (near №?#54) Аварийные
- (near №?#54) выключатели
- (near *?#69) B1
- (near *?#70) B2
- (near №?#53) 3
- (near №?#57) 4
- (near №?#53) Lck_cntr
- (near №?#57) Lck_cntr
- (near №?#55) 4
- (near ?#32) OUT4
- (near ?#28) Джампер XP4
- (near №?#59) Shield
- (near №?#58) SW2_cont
- (near №?#59) 4
- (near №?#58) 3
- (near *?#71) PE
- (near №?#62) 1
- (near №?#62) GND
- (near №?#60) 1
- (near №?#63) 2
- (near ?#32) OUT1
- (near №?#61) Аварийные
- (near №?#61) выключатели
- (near №?#68) Shield
- (near №?#64) DigIn3
- (near №?#61) +24V
- (near №?#64) 2
- (near №?#68) 3
- (near №?#61) 1
- (near №?#66) С
- (near №?#66) 1
- Датчик положения
- стола левый
- (near *?#72) Дроссель
  3YLN14
- (near *?#72) U1
- (near *?#76) W1
- (near *?#74) V1
- (near *?#73) U2
- (near *?#77) W2
- (near *?#75) V2
- (near *?#73) Двигатель линейного
- (near *?#73) перемещения
- (near №?#62) CAN-шина
- (near №?#65) 2
- (near №?#69) 3
- (near №?#72) 4
- (near №?#65) CAN_H
- (near №?#69) CAN_L
- (near №?#72) Shield
- (near №?#75) +24V
- (near №?#75) 1
- (near №?#67) 3
- (near №?#71) 4
- OUT3
- OUT4
- (near №?#70) NO
- (near №?#76) Shield
- (near №?#70) 2
- (near №?#76) 4
- (near №?#73) 3
- (near *?#78) PE
- (near №?#74) 5
- (near №?#74) E301
- (near *#16) к Z1
- (near *#17) к XT2
- (near *#18) к G1
- (near *#19) к G2
- (near *#20) к G3
- (near *#21) к XP101
- (near *#22) к XP102
- (near *#23) к XP103
- (near *#24) к XP104
- (near *#25) к XP105
- (near *#14) к XS109
- (near *#26) к XS112
- (near №?#78) 0V
- (near №?#81) GND
- (near №?#78) 2
- (near №?#81) 3
- (near №?#79) 1
- (near №?#79) +24V
- (near №?#77) Датчик положения
- (near №?#77) стола левый
- (near №?#83) Shield
- (near №?#80) DigIn4
- (near №?#77) +24V
- (near №?#80) 2
- (near №?#83) 3
- (near №?#77) 1
- (near №?#82) 2
- (near №?#85) 3
- (near №?#85) GND
- (near №?#82) DigIn1
- (near №?#79) Вход (Цифровой)
- (near №?#86) NO
- (near №?#84) C
- (near №?#86) 2
- (near №?#84) 1
- (near №?#87) 3
- стола правый
- (near ?#41) 1
- (near №?#90) GND
- (near №?#88) Датчик положения
- (near №?#88) стола правый
- (near №?#93) Shield
- (near №?#91) DigIn5
- (near №?#88) +24V
- (near №?#91) 2
- (near №?#93) 3
- (near №?#88) 1
- (near №?#89) Shield
- (near №?#89) 4
- (near ?#41) 2
- 6
- (near №?#92) CAN_H
- (near №?#94) CAN_L
- (near №?#97) NO
- (near №?#95) C
- (near №?#97) 2
- (near №?#95) 1
- (near №?#97) Кнопка
- разблокировки стола
- (near H1) A9
- (near ?#45) A10
- (near ?#46) A10
- 4
- 5
- 8
- (near №?#98) +24V
- (near №?#101) GND
- (near №?#96) Shield
- (near №?#92) CAN+POWER(24V)
- (near №?#99) Кнопка
- (near №?#99) разблокировки стола
- (near №?#104) Shield
- (near №?#102) DigIn6
- (near №?#99) +24V
- (near №?#102) 3
- (near №?#104) 4
- (near №?#99) 1
- (near №?#103) Shield
- (near №?#103) 4
- (near №?#100) 3
- (near ?#44) Корпус шкафа
- (near ?#45) Дверь шкафа
- (near ?#46) Панель монтажная
- A5
- (near №?#106) 1
- (near №?#105) +24V
- (near №?#105) 1
- * Устанавливается опционально
- (near ?#49) 1
- (near ?#49) 2
- (near №?#110) Tx-
- (near №?#107) Tx+
- (near ?#51) 1
- (near ?#52) 2
- Tx-
- (near ?#50) Tx+
- (near ?#50) Модуль расширения Ethernet
- (near ?#50) АДН200.80.01.400
- Джампер XP6
- (near №?#112) OUT3_24V
- (near №?#109) 2
- (near №?#112) 3
- (near №?#108) +24V
- (near №?#114) 0V
- (near №?#111) +24V
- (near №?#108) 2
- (near №?#111) 3
- (near №?#114) 4
- (near №?#108) Питание магниты
- 3
- (near №?#113) Rx+
- (near №?#116) NC
- (near ?#53) 3
- (near ?#54) 4
- Rx+
- NC
- (near №?#115) 4
- (near №?#117) 5
- (near №?#119) 6
- (near №?#124) 7
- (near №?#124) 5
- (near №?#124) 6
- (near №?#124) NC
- (near №?#118) NC
- (near №?#124) RX-
- (near ?#59) 7
- (near ?#56) 5
- (near ?#58) 6
- RX-
- (near ?#55) 2
- (near ?#55) 1
- (near №?#120) GND
- (near №?#122) CAN_H
- OUT1
- (near №?#126) 2
- (near №?#123) 1
- (near №?#127) 8
- (near №?#127) NC
- (near №?#130) корпус
- (near ?#60) 8
- корпус
- (near №?#125) CAN_L
- (near №?#128) Shield
- (near №?#122) CAN+POWER(24V)
- (near №?#129) 3
- (near №?#131) 4
- Электрооборудование шкафа управления FOBOS
- Labels drawn without touching a wire or pin: 46, 47, 48, GND
- Перв. примен.
- Справ. №
- Подп. и дата
- Инв. № дубл.
- Взам. инв. №
- Изм.
- Лист
- № докум.
- Подп.
- Дата
- Лит.
- Масса
- Масштаб
- Разраб.
- Т. контр.
- Пров.
- Листов
- Инв. № подл.
- Н. контр.
- Утв.
- Формат А2
- (in symbol circuit breaker) 1L1; 3L2; 4T2
- (in symbol circuit breaker 1P) 1L1
- (in symbol varistor) 1; U

## Library data of the parts
?#1-?#43 ?#47-?#61 = pin_1
  ?#3 ?#5-?#7 ?#10 ?#12-?#15 ?#17 ?#19 ?#23-?#25 ?#51-?#54 ?#56 ?#58-?#61: Обозначение?: Обозначение?
?#44-?#46 = КОНТ_ПЛ_1
FU1-FU5 = fuse
K1.1#1 K1.1#2 K1.2#1-K1.2#4 K?#1-K?#3 = SW SPST_1
KA?#1-KA?#3 = RELAY: Назначение: Контроль сигн.
QF1 = circuit breaker
QF2-QF4 = circuit breaker 1P
№?#1-№?#3 №?#10-№?#131 = pin_large: Обозначение?: Обозначение?
№?#4-№?#9 = pin_smallest: Parameter 1: Обозначение?